# Altium schematic sheet RoboCup2022.schdoc
size A; SheetNumber: 1; SheetTotal: 1
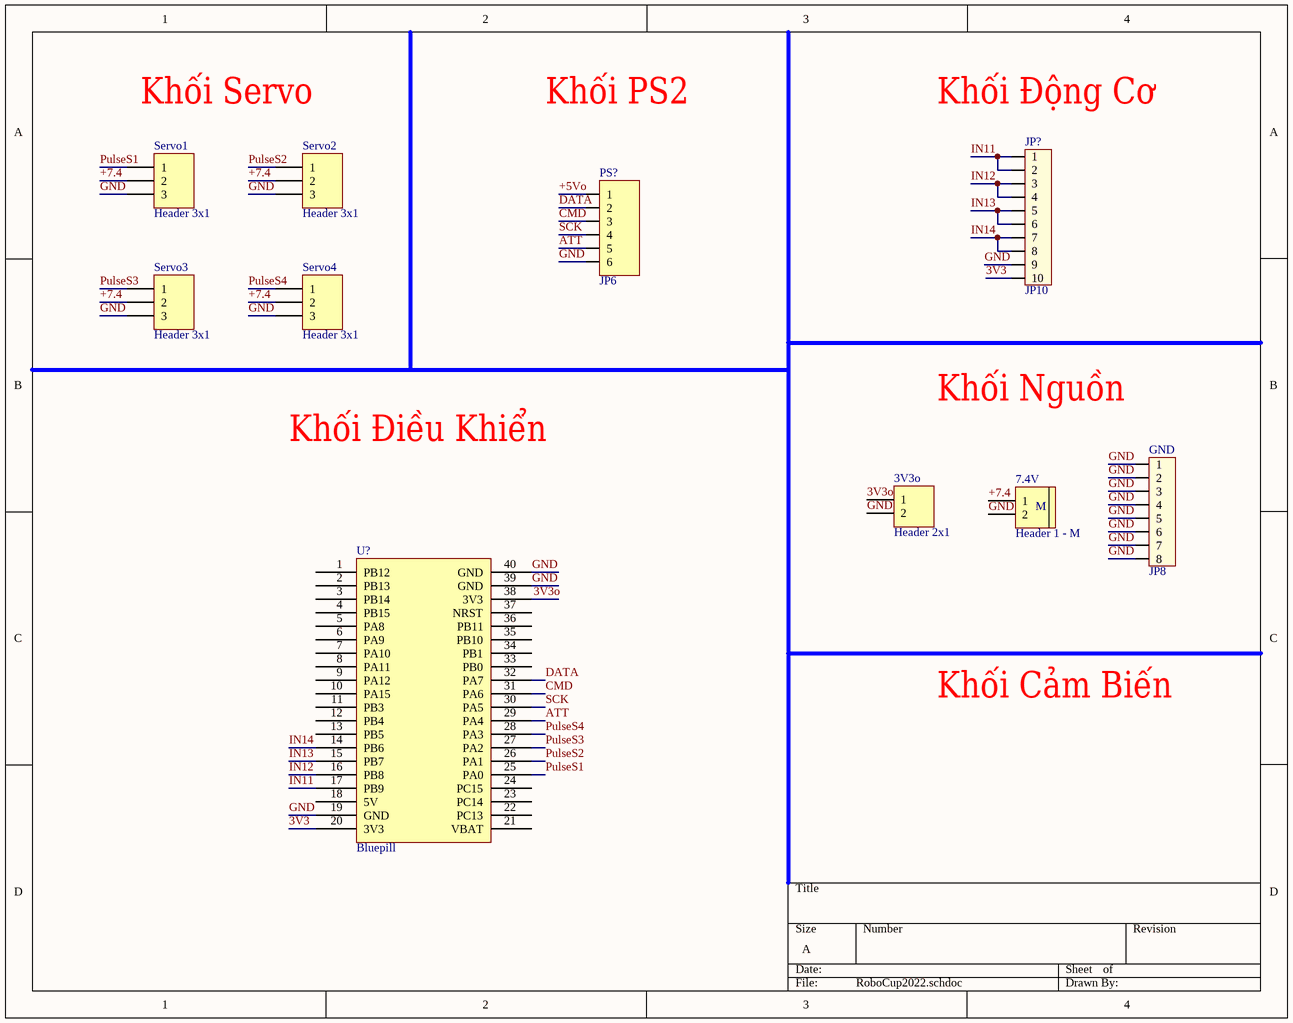
[diagram p0: RoboCup2022.schdoc]

## Parts
3V3o  Header 2x1  [HDR1X2]
7.4V  Header 1 - M  [Medium - Header 2]
GND  JP8  [Header8]
JP?  JP10  [Header10]
PS?  JP6  [JP6-C1T]
Servo1  Header 3x1  [HDR1X3]
Servo2  Header 3x1  [HDR1X3]
Servo3  Header 3x1  [HDR1X3]
Servo4  Header 3x1  [HDR1X3]
U?  Bluepill  [Blue Pill]

## Nets
3V3: JP?.10 U?.20(3V3)
3V3o: 3V3o.1 U?.38(3V3)
+5Vo: PS?.1
+7.4: 7.4V.1 Servo1.2 Servo2.2 Servo3.2 Servo4.2
ATT: PS?.5 U?.29(PA4)
CMD: PS?.3 U?.31(PA6)
DATA: PS?.2 U?.32(PA7)
GND: 3V3o.2 7.4V.2 GND.1 GND.2 GND.3 GND.4 GND.5 GND.6 GND.7 GND.8 JP?.9 PS?.6 Servo1.3 Servo2.3 Servo3.3 Servo4.3 U?.19(GND) U?.39(GND) U?.40(GND)
IN11: JP?.1 JP?.2 U?.17(PB9)
IN12: JP?.3 JP?.4 U?.16(PB8)
IN13: JP?.5 JP?.6 U?.15(PB7)
IN14: JP?.7 JP?.8 U?.14(PB6)
PulseS1: Servo1.1 U?.25(PA0)
PulseS2: Servo2.1 U?.26(PA1)
PulseS3: Servo3.1 U?.27(PA2)
PulseS4: Servo4.1 U?.28(PA3)
SCK: PS?.4 U?.30(PA5)

Not connected (* = marked no-connect by the designer): U? 1(PB12) 2(PB13) 3(PB14) 4(PB15) 5(PA8) 6(PA9) 7(PA10) 8(PA11) 9(PA12) 10(PA15) 11(PB3) 12(PB4) 13(PB5) 18(5V) 21(VBAT) 22(PC13) 23(PC14) 24(PC15) 33(PB0) 34(PB1) 35(PB10) 36(PB11) 37(NRST)

## Notes on the sheet
- Khối Servo
- Khối PS2
- (near JP?) Khối Động Cơ
- Khối Nguồn
- Khối Điều Khiển
- Khối Cảm Biến
- (in symbol Header 2 - M) M

## Library data of the parts
3V3o = Header 2x1: Header, 2-Pin, pitch 2.54mm; Solder: WAVE
7.4V = Header 2 - M: Header, 2-Pin, Medium; LatestRevisionDate: 17-Jul-2002; LatestRevisionNote: Re-released for DXP Platform.; Publisher: Altium Limited
GND = Header8: Connector 8; Value: Connector 8
JP? = Header10: Connector 10; Value: Connector 10
PS? = JP6: WR-PHD 2.54 mm Angled Socket Header; Manufacturer: W¨¹rth Elektronik eiSos GmbH; partNo: 613006143121; ComponentLink1 Description: Manufacturer; ComponentLink2 Description: Datasheet; NoPins: 06; Created Date: 29 March 2013; ComponentLink1URL: http://www.we-online.com; ComponentLink2URL: http://katalog.we-online.de/em/datasheet/6130xx143121.pdf; Created by: Karrer Zheng
Servo1-Servo4 = Header 3x1: Header, 3-Pin, pitch 2.54mm; Solder: WAVE
U? = STM32F103C8T6